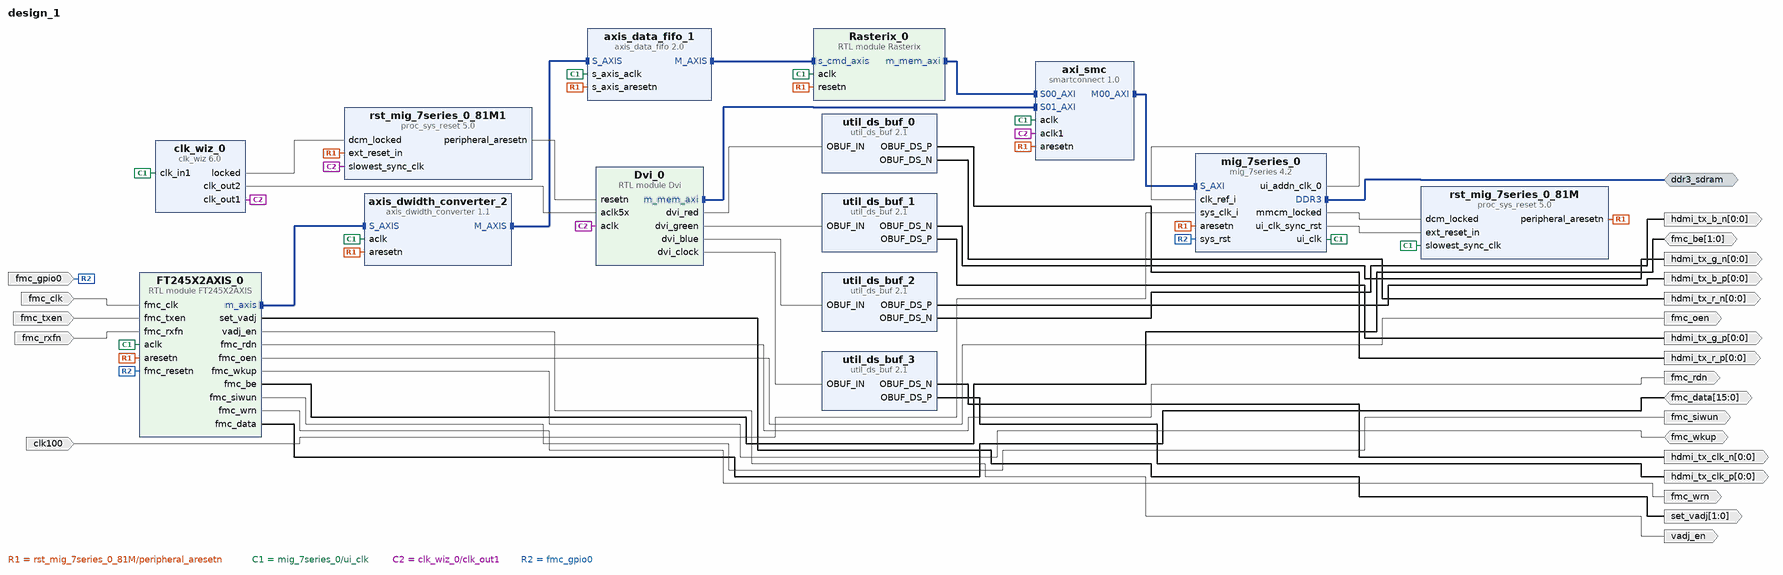
[diagram p0: block diagram of the top level]
# Vivado block design design_1, xc7a200tsbg484-1, Vivado 2020.1
create_bd_design design_1

create_bd_intf_port -mode Master -vlnv xilinx.com:interface:ddrx_rtl:1.0 ddr3_sdram
create_bd_port -dir I clk100
create_bd_port -dir O -from 0 -to 0 hdmi_tx_clk_n
create_bd_port -dir O -from 0 -to 0 hdmi_tx_clk_p
create_bd_port -dir O -from 0 -to 0 hdmi_tx_b_n
create_bd_port -dir O -from 0 -to 0 hdmi_tx_b_p
create_bd_port -dir O -from 0 -to 0 hdmi_tx_g_n
create_bd_port -dir O -from 0 -to 0 hdmi_tx_g_p
create_bd_port -dir O -from 0 -to 0 hdmi_tx_r_n
create_bd_port -dir O -from 0 -to 0 hdmi_tx_r_p
create_bd_port -dir O -from 1 -to 0 set_vadj
create_bd_port -dir O vadj_en
create_bd_port -dir O fmc_rdn
create_bd_port -dir O fmc_oen
create_bd_port -dir IO -from 1 -to 0 fmc_be
create_bd_port -dir O fmc_siwun
create_bd_port -dir O fmc_wrn
create_bd_port -dir I fmc_gpio0
create_bd_port -dir I fmc_clk
create_bd_port -dir I fmc_txen
create_bd_port -dir I fmc_rxfn
create_bd_port -dir IO fmc_wkup
create_bd_port -dir IO -from 15 -to 0 fmc_data

create_bd_cell -type ip -vlnv xilinx.com:ip:smartconnect:1.0 axi_smc
set_property -dict [list \
  CONFIG.ADVANCED_PROPERTIES {          __view__ { functional { S02_Entry { PKT_W_THR 128 } S02_Buffer { W_SIZE 256 } S00_Entry { PKT_W_THR 16 } } }         } \
  CONFIG.NUM_CLKS 2 \
  CONFIG.NUM_MI 1 \
  CONFIG.NUM_SI 2 \
] [get_bd_cells axi_smc]
create_bd_cell -type ip -vlnv xilinx.com:ip:axis_data_fifo:2.0 axis_data_fifo_1
set_property -dict [list \
  CONFIG.FIFO_DEPTH 512 \
  CONFIG.FIFO_MEMORY_TYPE distributed \
  CONFIG.TDATA_NUM_BYTES 16 \
] [get_bd_cells axis_data_fifo_1]
create_bd_cell -type ip -vlnv xilinx.com:ip:axis_dwidth_converter:1.1 axis_dwidth_converter_2
set_property -dict {CONFIG.M_TDATA_NUM_BYTES 16} [get_bd_cells axis_dwidth_converter_2]
create_bd_cell -type ip -vlnv xilinx.com:ip:mig_7series:4.2 mig_7series_0
set_property -dict [list \
  CONFIG.BOARD_MIG_PARAM ddr3_sdram \
  CONFIG.MIG_DONT_TOUCH_PARAM Custom \
  CONFIG.RESET_BOARD_INTERFACE reset \
  CONFIG.XML_INPUT_FILE ../../mig_b.prj \
] [get_bd_cells mig_7series_0]
create_bd_cell -type ip -vlnv xilinx.com:ip:proc_sys_reset:5.0 rst_mig_7series_0_81M
create_bd_cell -type ip -vlnv xilinx.com:ip:clk_wiz:6.0 clk_wiz_0
set_property -dict [list \
  CONFIG.CLKIN1_JITTER_PS 100.0 \
  CONFIG.CLKIN2_JITTER_PS 333.33000000000004 \
  CONFIG.CLKOUT1_DRIVES BUFG \
  CONFIG.CLKOUT1_JITTER 151.636 \
  CONFIG.CLKOUT1_PHASE_ERROR 98.575 \
  CONFIG.CLKOUT1_REQUESTED_OUT_FREQ 50 \
  CONFIG.CLKOUT1_USED true \
  CONFIG.CLKOUT2_DRIVES BUFG \
  CONFIG.CLKOUT2_JITTER 110.209 \
  CONFIG.CLKOUT2_PHASE_ERROR 98.575 \
  CONFIG.CLKOUT2_REQUESTED_OUT_FREQ 250 \
  CONFIG.CLKOUT2_USED true \
  CONFIG.CLKOUT3_DRIVES BUFG \
  CONFIG.CLKOUT3_REQUESTED_OUT_FREQ 100.000 \
  CONFIG.CLKOUT4_DRIVES BUFG \
  CONFIG.CLKOUT4_REQUESTED_OUT_FREQ 100.000 \
  CONFIG.CLKOUT5_DRIVES BUFG \
  CONFIG.CLKOUT5_REQUESTED_OUT_FREQ 100.000 \
  CONFIG.CLKOUT6_DRIVES BUFG \
  CONFIG.CLKOUT6_REQUESTED_OUT_FREQ 100.000 \
  CONFIG.CLKOUT7_DRIVES BUFG \
  CONFIG.CLKOUT7_REQUESTED_OUT_FREQ 100.000 \
  CONFIG.ENABLE_CLOCK_MONITOR false \
  CONFIG.FEEDBACK_SOURCE FDBK_AUTO \
  CONFIG.MMCM_BANDWIDTH OPTIMIZED \
  CONFIG.MMCM_CLKFBOUT_MULT_F 10.000 \
  CONFIG.MMCM_CLKIN1_PERIOD 10.000 \
  CONFIG.MMCM_CLKIN2_PERIOD 10.000 \
  CONFIG.MMCM_CLKOUT0_DIVIDE_F 20.000 \
  CONFIG.MMCM_CLKOUT1_DIVIDE 4 \
  CONFIG.MMCM_COMPENSATION ZHOLD \
  CONFIG.MMCM_DIVCLK_DIVIDE 1 \
  CONFIG.NUM_OUT_CLKS 2 \
  CONFIG.PLL_CLKIN_PERIOD 20.000 \
  CONFIG.PRIMITIVE MMCM \
  CONFIG.PRIM_IN_FREQ 100 \
  CONFIG.RESET_BOARD_INTERFACE Custom \
  CONFIG.RESET_PORT reset \
  CONFIG.RESET_TYPE ACTIVE_HIGH \
  CONFIG.SECONDARY_IN_FREQ 100.000 \
  CONFIG.SECONDARY_SOURCE Single_ended_clock_capable_pin \
  CONFIG.USE_FREQ_SYNTH true \
  CONFIG.USE_INCLK_SWITCHOVER false \
  CONFIG.USE_RESET false \
] [get_bd_cells clk_wiz_0]
create_bd_cell -type ip -vlnv xilinx.com:ip:util_ds_buf:2.1 util_ds_buf_0
set_property -dict {CONFIG.C_BUF_TYPE OBUFDS} [get_bd_cells util_ds_buf_0]
create_bd_cell -type ip -vlnv xilinx.com:ip:util_ds_buf:2.1 util_ds_buf_1
set_property -dict {CONFIG.C_BUF_TYPE OBUFDS} [get_bd_cells util_ds_buf_1]
create_bd_cell -type ip -vlnv xilinx.com:ip:util_ds_buf:2.1 util_ds_buf_2
set_property -dict {CONFIG.C_BUF_TYPE OBUFDS} [get_bd_cells util_ds_buf_2]
create_bd_cell -type ip -vlnv xilinx.com:ip:util_ds_buf:2.1 util_ds_buf_3
set_property -dict {CONFIG.C_BUF_TYPE OBUFDS} [get_bd_cells util_ds_buf_3]
create_bd_cell -type ip -vlnv xilinx.com:ip:proc_sys_reset:5.0 rst_mig_7series_0_81M1
create_bd_cell -type module -reference FT245X2AXIS FT245X2AXIS_0
create_bd_cell -type module -reference Dvi Dvi_0
create_bd_cell -type module -reference Rasterix Rasterix_0
set_property -dict [list \
  CONFIG.ADDR_WIDTH 28 \
  CONFIG.CMD_STREAM_WIDTH 128 \
  CONFIG.STRB_WIDTH 16 \
  CONFIG.TEXTURE_BUFFER_SIZE 17 \
  CONFIG.TMU_COUNT 2 \
] [get_bd_cells Rasterix_0]

# ---- connections ----

connect_bd_intf_net [get_bd_intf_pins axis_dwidth_converter_2/M_AXIS] [get_bd_intf_pins axis_data_fifo_1/S_AXIS]
connect_bd_intf_net [get_bd_intf_pins FT245X2AXIS_0/m_axis] [get_bd_intf_pins axis_dwidth_converter_2/S_AXIS]
connect_bd_intf_net [get_bd_intf_pins axi_smc/M00_AXI] [get_bd_intf_pins mig_7series_0/S_AXI]
connect_bd_intf_net [get_bd_intf_pins Rasterix_0/s_cmd_axis] [get_bd_intf_pins axis_data_fifo_1/M_AXIS]
connect_bd_intf_net [get_bd_intf_pins Dvi_0/m_mem_axi] [get_bd_intf_pins axi_smc/S01_AXI]
connect_bd_intf_net [get_bd_intf_ports ddr3_sdram] [get_bd_intf_pins mig_7series_0/DDR3]
connect_bd_intf_net [get_bd_intf_pins Rasterix_0/m_mem_axi] [get_bd_intf_pins axi_smc/S00_AXI]
connect_bd_net [get_bd_pins mig_7series_0/ui_addn_clk_0] [get_bd_pins mig_7series_0/clk_ref_i]
connect_bd_net [get_bd_pins mig_7series_0/mmcm_locked] [get_bd_pins rst_mig_7series_0_81M/dcm_locked]
connect_bd_net [get_bd_pins mig_7series_0/ui_clk_sync_rst] [get_bd_pins rst_mig_7series_0_81M/ext_reset_in]
connect_bd_net [get_bd_pins rst_mig_7series_0_81M/peripheral_aresetn] \
  [get_bd_pins axi_smc/aresetn] [get_bd_pins axis_data_fifo_1/s_axis_aresetn] [get_bd_pins axis_dwidth_converter_2/aresetn] \
  [get_bd_pins mig_7series_0/aresetn] [get_bd_pins rst_mig_7series_0_81M1/ext_reset_in] [get_bd_pins FT245X2AXIS_0/aresetn] \
  [get_bd_pins Rasterix_0/resetn]
connect_bd_net [get_bd_pins mig_7series_0/ui_clk] \
  [get_bd_pins axi_smc/aclk] [get_bd_pins axis_data_fifo_1/s_axis_aclk] [get_bd_pins axis_dwidth_converter_2/aclk] \
  [get_bd_pins rst_mig_7series_0_81M/slowest_sync_clk] [get_bd_pins clk_wiz_0/clk_in1] [get_bd_pins FT245X2AXIS_0/aclk] \
  [get_bd_pins Rasterix_0/aclk]
connect_bd_net [get_bd_pins clk_wiz_0/clk_out1] \
  [get_bd_pins axi_smc/aclk1] [get_bd_pins rst_mig_7series_0_81M1/slowest_sync_clk] [get_bd_pins Dvi_0/aclk]
connect_bd_net [get_bd_pins util_ds_buf_0/OBUF_DS_P] [get_bd_ports hdmi_tx_r_p]
connect_bd_net [get_bd_pins util_ds_buf_0/OBUF_DS_N] [get_bd_ports hdmi_tx_r_n]
connect_bd_net [get_bd_pins util_ds_buf_1/OBUF_DS_P] [get_bd_ports hdmi_tx_g_p]
connect_bd_net [get_bd_pins util_ds_buf_1/OBUF_DS_N] [get_bd_ports hdmi_tx_g_n]
connect_bd_net [get_bd_pins util_ds_buf_2/OBUF_DS_P] [get_bd_ports hdmi_tx_b_p]
connect_bd_net [get_bd_pins util_ds_buf_2/OBUF_DS_N] [get_bd_ports hdmi_tx_b_n]
connect_bd_net [get_bd_pins util_ds_buf_3/OBUF_DS_P] [get_bd_ports hdmi_tx_clk_p]
connect_bd_net [get_bd_pins util_ds_buf_3/OBUF_DS_N] [get_bd_ports hdmi_tx_clk_n]
connect_bd_net [get_bd_pins rst_mig_7series_0_81M1/peripheral_aresetn] [get_bd_pins Dvi_0/resetn]
connect_bd_net [get_bd_pins clk_wiz_0/clk_out2] [get_bd_pins Dvi_0/aclk5x]
connect_bd_net [get_bd_pins clk_wiz_0/locked] [get_bd_pins rst_mig_7series_0_81M1/dcm_locked]
connect_bd_net [get_bd_pins Dvi_0/dvi_red] [get_bd_pins util_ds_buf_0/OBUF_IN]
connect_bd_net [get_bd_pins Dvi_0/dvi_green] [get_bd_pins util_ds_buf_1/OBUF_IN]
connect_bd_net [get_bd_pins Dvi_0/dvi_blue] [get_bd_pins util_ds_buf_2/OBUF_IN]
connect_bd_net [get_bd_pins Dvi_0/dvi_clock] [get_bd_pins util_ds_buf_3/OBUF_IN]
connect_bd_net -net fmc_gpio0_1 [get_bd_ports fmc_gpio0] [get_bd_pins mig_7series_0/sys_rst] [get_bd_pins FT245X2AXIS_0/fmc_resetn]
connect_bd_net [get_bd_ports fmc_clk] [get_bd_pins FT245X2AXIS_0/fmc_clk]
connect_bd_net [get_bd_ports fmc_txen] [get_bd_pins FT245X2AXIS_0/fmc_txen]
connect_bd_net [get_bd_ports fmc_rxfn] [get_bd_pins FT245X2AXIS_0/fmc_rxfn]
connect_bd_net [get_bd_pins FT245X2AXIS_0/set_vadj] [get_bd_ports set_vadj]
connect_bd_net [get_bd_pins FT245X2AXIS_0/vadj_en] [get_bd_ports vadj_en]
connect_bd_net [get_bd_pins FT245X2AXIS_0/fmc_rdn] [get_bd_ports fmc_rdn]
connect_bd_net [get_bd_pins FT245X2AXIS_0/fmc_oen] [get_bd_ports fmc_oen]
connect_bd_net [get_bd_ports fmc_wkup] [get_bd_pins FT245X2AXIS_0/fmc_wkup]
connect_bd_net [get_bd_ports fmc_be] [get_bd_pins FT245X2AXIS_0/fmc_be]
connect_bd_net [get_bd_pins FT245X2AXIS_0/fmc_siwun] [get_bd_ports fmc_siwun]
connect_bd_net [get_bd_pins FT245X2AXIS_0/fmc_wrn] [get_bd_ports fmc_wrn]
connect_bd_net [get_bd_ports fmc_data] [get_bd_pins FT245X2AXIS_0/fmc_data]
connect_bd_net -net util_ds_buf_4_BUFG_O [get_bd_ports clk100] [get_bd_pins mig_7series_0/sys_clk_i]

# ---- address map ----
assign_bd_address -offset 0x00000000 -range 512M -target_address_space [get_bd_addr_spaces Dvi_0/m_mem_axi] [get_bd_addr_segs mig_7series_0/memmap/memaddr]
assign_bd_address -offset 0x0000000 -range 256M -target_address_space [get_bd_addr_spaces Rasterix_0/m_mem_axi] [get_bd_addr_segs mig_7series_0/memmap/memaddr]

validate_bd_design
save_bd_design
